# EAGLE design esp8266-board (EAGLE 7.6.0)
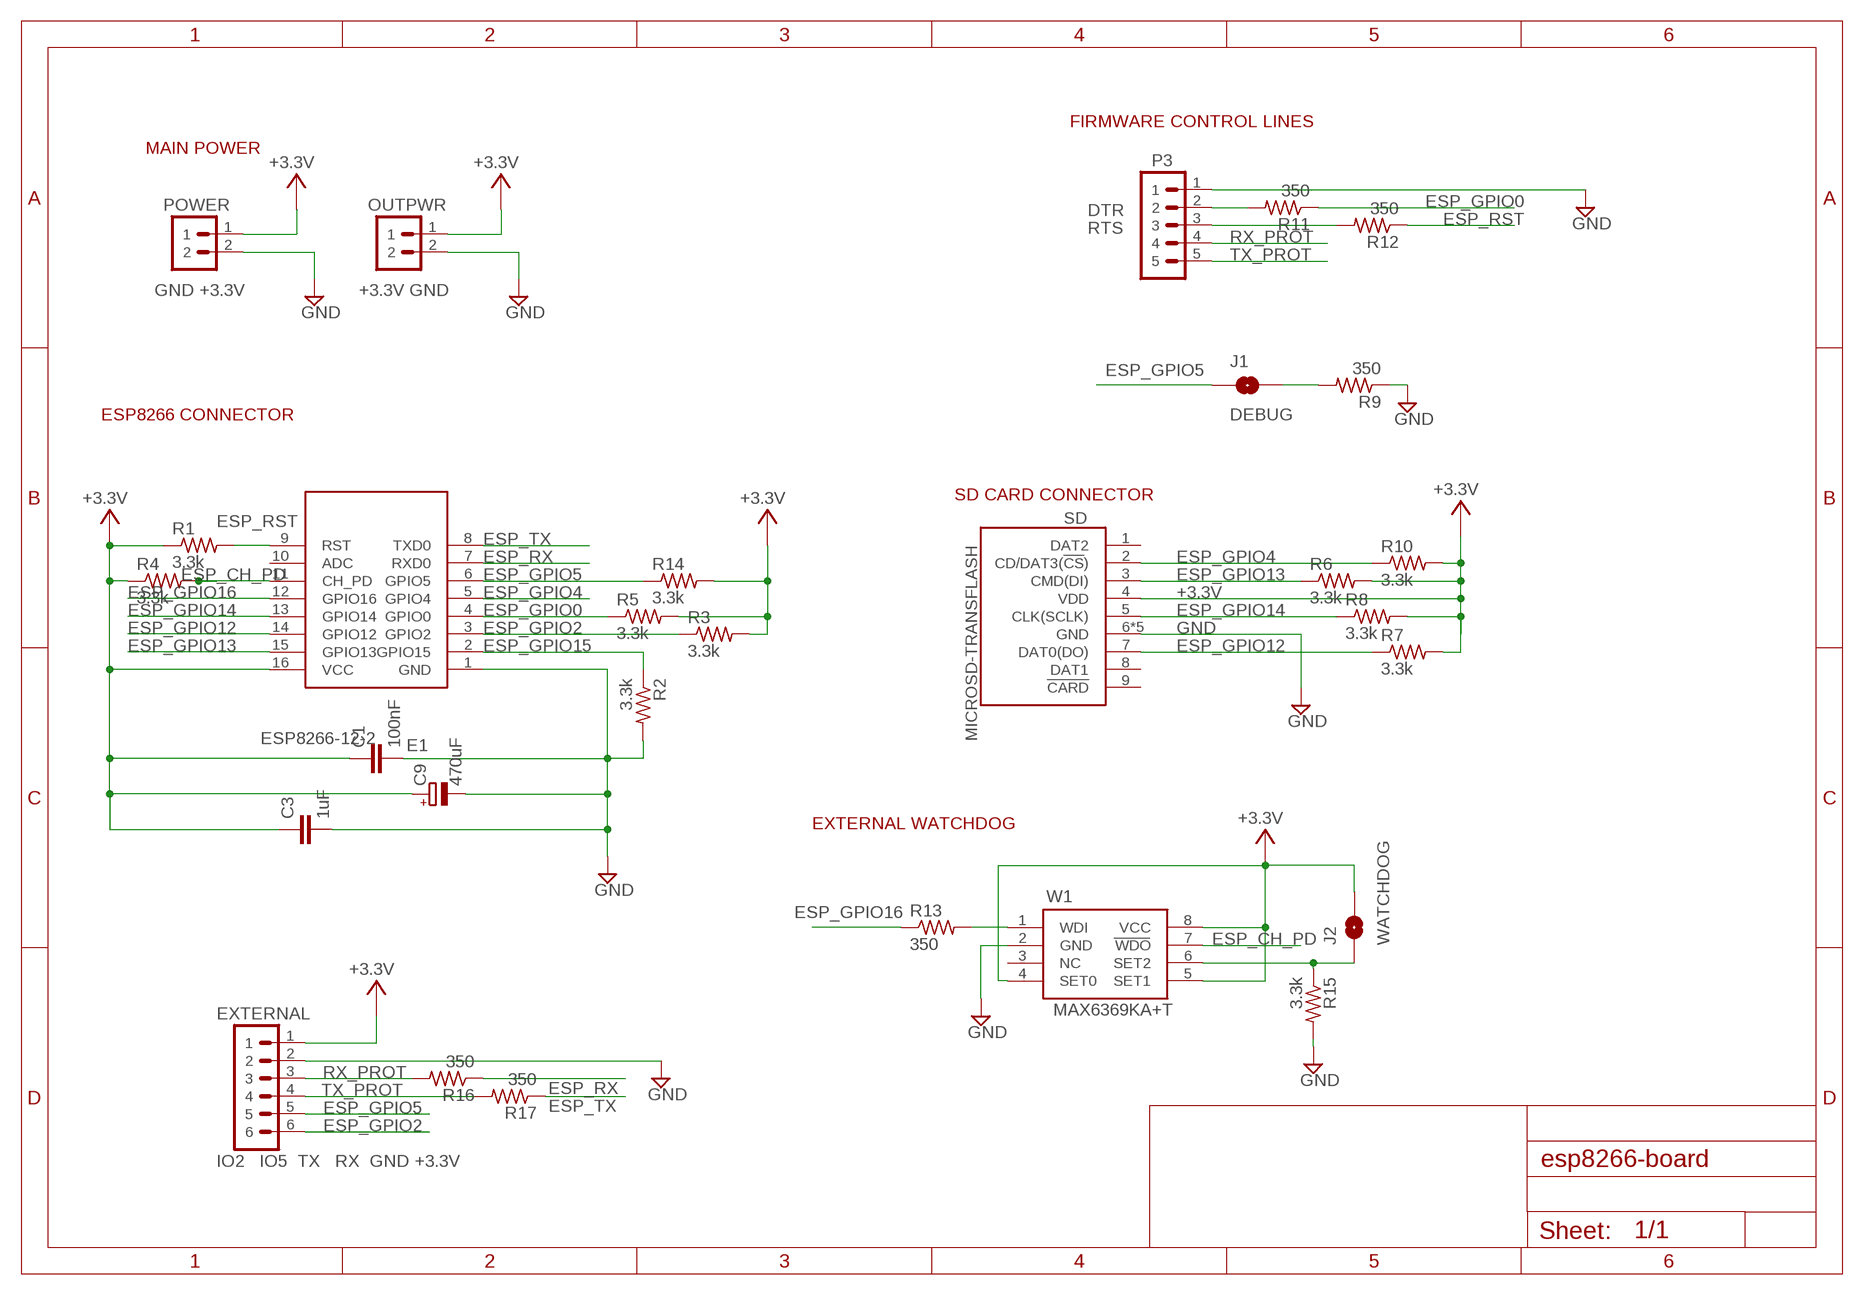
[diagram p0: schematic, sheet 1]

## Parts
C1  100nF  CAPACITOR0805  [SMD0805]
C3  1uF  CAPACITOR0805  [SMD0805]
C9  470uF  CPOL-EUE2.5-6  [E2,5-6]
E1  ESP8266-12-2  [ESP8266-12-2]
EXTERNAL  IO2 IO5 TX RX GND +3.3V  PIN-HEADER-6PIN  [PIN-HEADER-6PIN]
J1  DEBUG  JUMPER-PAD-2ROUND  [JUMPER-PAD-2-ROUND]
J2  WATCHDOG  JUMPER-PAD-2ROUND  [JUMPER-PAD-2-ROUND]
OUTPWR  +3.3V GND  PIN-HEADER-2PIN  [PIN-HEADER-2PIN]
P3  GND DTR RTS RX TX  PIN-HEADER-5PIN  [PIN-HEADER-5PIN]
POWER  GND +3.3V  PIN-HEADER-2PIN  [PIN-HEADER-2PIN]
R1  3.3k  RESISTOR0805  [SMD0805]
R2  3.3k  RESISTOR0805  [SMD0805]
R3  3.3k  RESISTOR0805  [SMD0805]
R4  3.3k  RESISTOR0805  [SMD0805]
R5  3.3k  RESISTOR0805  [SMD0805]
R6  3.3k  RESISTOR0805  [SMD0805]
R7  3.3k  RESISTOR0805  [SMD0805]
R8  3.3k  RESISTOR0805  [SMD0805]
R9  350  RESISTOR0805  [SMD0805]
R10  3.3k  RESISTOR0805  [SMD0805]
R11  350  RESISTOR0805  [SMD0805]
R12  350  RESISTOR0805  [SMD0805]
R13  350  RESISTOR0805  [SMD0805]
R14  3.3k  RESISTOR0805  [SMD0805]
R15  3.3k  RESISTOR0805  [SMD0805]
R16  350  RESISTOR0805  [SMD0805]
R17  350  RESISTOR0805  [SMD0805]
SD  MICROSD-TRANSFLASH  [MICROSD-TRANSFLASH]
W1  MAX6369KA+T  MAX6369-74  [SOT23-8]

## Nets
+3.3V [power-1A]: C1.1 C3.1 C9.+ E1.16(VCC) EXTERNAL.1 J2.2 OUTPWR.1 POWER.1 R1.1 R3.2 R4.1 R5.2 R6.2 R7.2 R8.2 R10.2 R14.2 SD.4(VDD) W1.4(SET0) W1.5(SET1) W1.8(VCC)
ESP_CH_PD: E1.11(CH_PD) R4.2 W1.7(WDO)
ESP_GPIO0: E1.4(GPIO0) R5.1 R11.1
ESP_GPIO2: E1.3(GPIO2) EXTERNAL.6 R3.1
ESP_GPIO4: E1.5(GPIO4) R10.1 SD.2(CD/DAT3(!CS!))
ESP_GPIO5: E1.6(GPIO5) EXTERNAL.5 J1.1 R14.1
ESP_GPIO12: E1.14(GPIO12) R7.1 SD.7(DAT0(DO))
ESP_GPIO13: E1.15(GPIO13) R6.1 SD.3(CMD(DI))
ESP_GPIO14: E1.13(GPIO14) R8.1 SD.5(CLK(SCLK))
ESP_GPIO15: E1.2(GPIO15) R2.1
ESP_GPIO16: E1.12(GPIO16) R13.1
ESP_RST: E1.9(RST) R1.2 R12.1
ESP_RX: E1.7(RXD0) R16.1
ESP_TX: E1.8(TXD0) R17.1
GND [power-1A]: C1.2 C3.2 C9.- E1.1(GND) EXTERNAL.2 OUTPWR.2 P3.1 POWER.2 R2.2 R9.1 R15.2 SD.6(GND) SD.S1(GND) SD.S2(GND) SD.S3(GND) SD.S4(GND) W1.2(GND)
N$1: J2.1 R15.1 W1.6(SET2)
N$6: J1.2 R9.2
N$7: P3.2 R11.2
N$8: P3.3 R12.2
N$10: R13.2 W1.1(WDI)
RX_PROT: EXTERNAL.3 P3.4 R16.2
TX_PROT: EXTERNAL.4 P3.5 R17.2
Unconnected: E1.10(ADC) SD.1(DAT2) SD.8(DAT1) SD.9(!CARD) W1.3(NC)

## Notes on the sheet
- FIRMWARE CONTROL LINES
- MAIN POWER
- DTR
- RTS
- ESP8266 CONNECTOR
- SD CARD CONNECTOR
- EXTERNAL WATCHDOG

## Library data of the parts
C1 C3 = stutz-components-library:CAPACITOR
C9 = rcl:CPOL-EU: POLARIZED CAPACITOR, European symbol
E1 = stutz-components-library:ESP8266-12-2
EXTERNAL = stutz-components-library:PIN-HEADER-6PIN
J1 J2 = stutz-components-library:JUMPER-PAD-2
OUTPWR POWER = stutz-components-library:PIN-HEADER-2PIN
P3 = stutz-components-library:PIN-HEADER-5PIN
R1-R17 = stutz-components-library:RESISTOR
SD = stutz-components-library:MICROSD-TRANSFLASH
W1 = stutz-components-library:MAX6369-74

## Net classes
0 default: width 0.254 mm, clearance 0.16 mm
1 power-4A: width 2 mm, clearance 0.2 mm
2 comm-rs485: width 1 mm, clearance 0.2 mm
3 power-2A: width 1 mm, clearance 0.2 mm
4 power-1.7A: width 0.8 mm, clearance 0.2 mm
5 power-1A: width 0.254 mm, clearance 0.2 mm

## Board
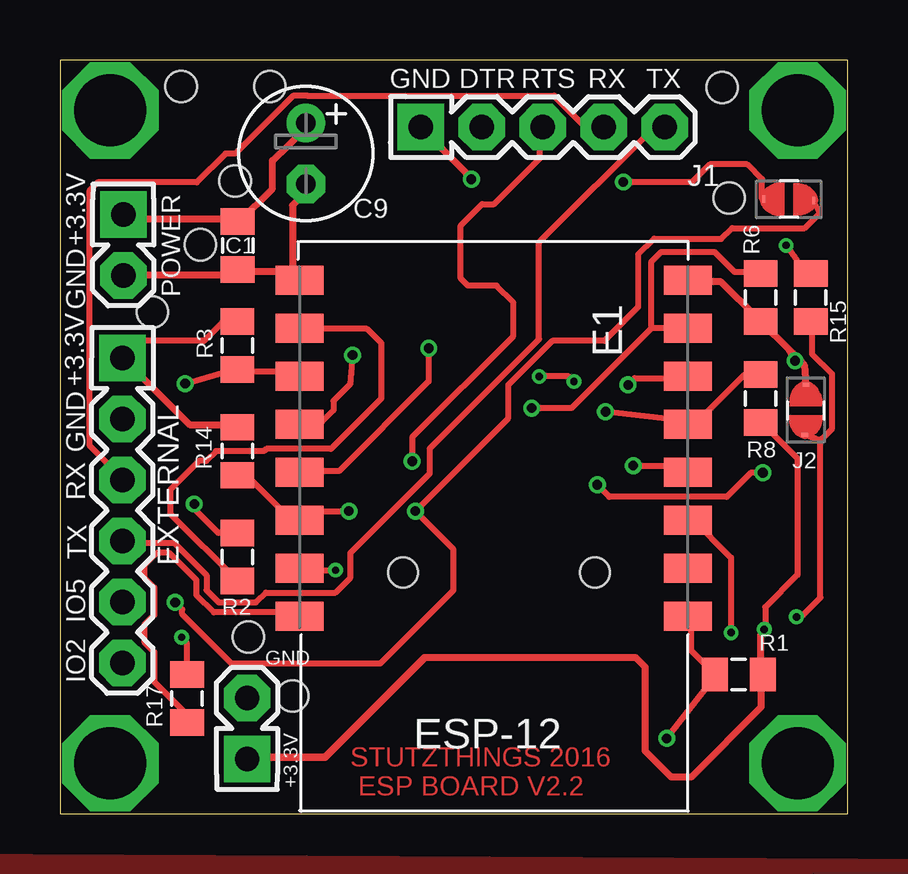
[diagram p1: board, top side]
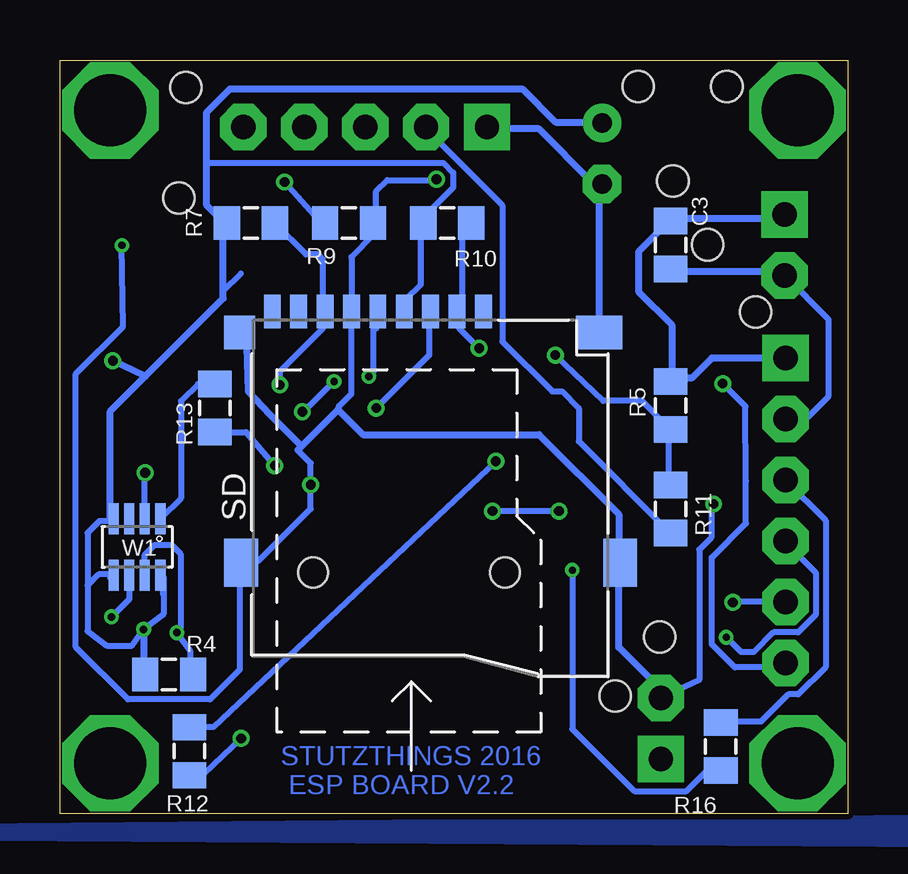
[diagram p2: board, bottom side, seen from below]

Size 32.85 x 31.4 mm. Coordinates in mm from the lower left corner, seen from the top.
Outline: 0,0 32.85,0 32.85,31.4 0,31.4 0,0
Copper layers (1*16): Top 0.035mm / dielectric 1.5mm / Bottom 0.035mm
Design rules "SeeedStudio_2layer_DRU_no_angle_20140221": minimum track width 6mil, minimum drill 12mil, track to track 6mil, track to pad 6mil, pad to pad 6mil, via to via 6mil, smd to smd 0mil, copper to edge 10mil, drill to drill 10mil, minimum pad ring 10mil, minimum via ring 6mil, stop-mask expansion 2mil, vias tented up to drill 100mil, thermal gap 10mil
Holes 1.3 mm at 7.85,7.35 9.7,4.9 3.85,20.9 7.3,26.35 5.05,30.3 8.75,30.3 5.85,23.7 27.9,25.65 27.6,30.25
bRestrict: area 12.1,0.8 to 24.1,6.2

### Footprints (pad centres in the part's own frame; a part is rotated, then mirrored left to right if it is on the bottom)
SMD0805 = smd 1.1 x 1.4: 1 -1,0; 2 1,0
E2,5-6 = drill 0.813 pad 1.6: + -1.27,0 | drill 0.813 pad 1.6 octagon: - 1.27,0
ESP8266-12-2 = smd 2 x 1.2: 1 7.818,-8.922; 2 7.818,-6.922; 3 7.818,-4.922; 4 7.818,-2.922; 5 7.818,-0.922; 6 7.818,1.078; 7 7.818,3.078; 8 7.818,5.078; 9 -8.382,5.078; 10 -8.382,3.078; 11 -8.382,1.078; 12 -8.382,-0.922; 13 -8.382,-2.922; 14 -8.382,-4.922; 15 -8.382,-6.922; 16 -8.382,-8.922
PIN-HEADER-6PIN = drill 1.016 pad 1.93 square: 1 -5.08,0 | drill 1.016 pad 1.93 octagon: 2 -2.54,0; 3 0,0; 4 2.54,0; 5 5.08,0; 6 7.62,0
JUMPER-PAD-2-ROUND = smd 0.152 x 0.305: 1 -1.016,0.051; 2 1.067,0
PIN-HEADER-2PIN = drill 1.016 pad 1.93 square: 1 -1.27,0 | drill 1.016 pad 1.93 octagon: 2 1.27,0
PIN-HEADER-5PIN = drill 1.016 pad 1.93 square: 1 -5.08,0 | drill 1.016 pad 1.93 octagon: 2 -2.54,0; 3 0,0; 4 2.54,0; 5 5.08,0
MICROSD-TRANSFLASH = smd 1.4 x 0.7: 1 15.22,5.2; 2 15.22,6.3; 3 15.22,7.4; 4 15.22,8.5; 5 15.22,9.6; 6 15.22,10.7; 7 15.22,11.8; 8 15.22,12.9; 9 15.22,14 | smd 2 x 1.4: S1 4.75,-0.5; S2 4.75,15.3 | smd 1.4 x 1.28: S3 14.35,15.36 | smd 1.4 x 1.95: S4 14.35,0.375 | hole 1.25: 4.35,4.3; 4.35,12.3
SOT23-8 = smd 0.42 x 1.3: 1 0.936,1.08; 2 0.286,1.08; 3 -0.364,1.08; 4 -1.014,1.08; 5 -1.014,-1.27; 6 -0.364,-1.27; 7 0.286,-1.27; 8 0.936,-1.27

### Placement (x,y rotation side)
C1  7.41,23.66 270 top
C3  7.4,23.7 270 bottom
C9  10.25,27.5 270 top
E1  17.8,13.3 180 top
EXTERNAL  2.6,13.9 270 top
J1  30.4,25.6 180 top
J2  31.1,16.8 90 top
OUTPWR  7.8,3.55 90 top
P3  20.13,28.6 0 top
POWER  2.64,23.69 270 top
R1  28.3,5.8 180 top
R2  7.4,10.7 90 top
R3  7.4,19.5 90 top
R4  28.3,5.8 0 bottom
R5  7.4,17 90 bottom
R6  29.2,21.5 270 top
R7  24.9,24.6 180 bottom
R8  29.2,17.3 270 top
R9  20.8,24.6 180 bottom
R10  16.7,24.6 180 bottom
R11  7.4,12.7 270 bottom
R12  27.45,2.6 90 bottom
R13  26.4,16.9 90 bottom
R14  7.4,15.1 90 top
R15  31.3,21.5 90 top
R16  5.3,2.8 90 bottom
R17  5.3,4.8 90 top
SD  10,5.7 90 bottom
W1  29.6,11.2 0 bottom

### Tracks (layer width: path | path; a pad name or v marks a point on that pad's centre or on a via)
+3.3V  (via drill 0.31, 0.4)
  Top 0.254: R3.2 6.8,20.5 6,19.7 3.32,19.7 EXTERNAL.1 | 29.22,16.2 29.34,16.2 30.75,14.8 30.75,9.95 29.4,8.6 29.4,7.72 v29.36,7.68
  Top 0.3: R14.2 7.34,16.2 5.4,16.2 2.63,18.97 EXTERNAL.1 | POWER.1 2.77,24.93 2.91,24.79 7.34,24.79 C1.1 7.48,24.65 8.86,26.04 8.86,27.2 10.23,28.52 10.53,28.67 C9.+ | 30.4,19.32 29.22,20.5 R6.2 29.09,20.64 27.56,22.16 26.32,22.16 E1.16 | 30.4,19.32 31.02,18.7 J2.2 | v30.65,18.87 30.4,19.32 | 29.22,16.2 R8.2 | 7.2,2.08 OUTPWR.1 8.03,2.13 | v29.36,7.68 29.22,7.48 29.22,5.82 R4.1 29.22,5.68 29.22,4.43 26.32,1.52 25.48,1.52 24.4,2.61 24.4,6.1 24,6.5 15.19,6.5
  Top 0.305: 15.19,6.5 15.19,6.49 11.05,2.35 7.87,2.35 OUTPWR.1
  Bottom 0.254: 30.75,12.19 31.21,12.19 31.7,11.7 31.7,9.5 | 31.7,9.5 31.7,7.6 30.9,7 29.84,7 v29.36,7.68 28.53,8.31 28.53,9.14 | 30.75,9.97 31.23,9.97 31.7,9.5 | 26.04,21.47 26.04,21.76 25.3,22.5 | SD.4 18.42,21.01 18.42,21.42 17.8,22.05 17.8,24.53 R10.2 17.59,24.63 17.59,24.94 16.46,26.08 16.46,26.7 16.87,27.12 26.73,27.12
  Bottom 0.3: 7.48,18 R5.2 | R5.2 7.34,18.14 6.51,18.14 5.68,18.97 2.63,18.97 EXTERNAL.1 | POWER.1 2.77,24.93 2.91,24.79 7.34,24.79 C3.1 7.48,24.65 8.73,23.41 8.73,21.74 7.34,20.36 7.34,18.28 R5.2 | 28.53,9.14 28.53,9.83 W1.8 | 30.75,9.83 W1.5 30.75,9.97 | 30.75,12.19 W1.4 30.75,12.33 30.75,16.76 29.29,18.21 | v29.36,7.68 29.36,5.82 R4.1 | 29.29,18.21 26.04,21.47 26.04,24.52 R7.2 26.04,24.65 26.73,25.35 26.73,27.12 26.73,29.22 25.76,30.19 13.57,30.19 12.19,28.81 10.66,28.81 C9.+ | 29.29,18.21 v30.65,18.87
ESP_CH_PD  (via drill 0.31)
  Top 0.254: v27.98,7.54 27.98,10.66 26.32,12.33 E1.11
  Bottom 0.254: R4.2 27.42,5.82 27.42,6.79 v27.98,7.54 27.82,7.7 27.82,10.82 28.2,11.2 28.9,11.2 29.31,10.79 W1.7
ESP_GPIO0  (via drill 0.4)
  Top 0.254: v12.2,19.1 12.1,17.9 11.4,17.2 11.4,16.8 10.5,15.9 10.3,15.9 E1.4
  Bottom 0.254: 7.48,13.71 R11.1 7.48,13.78 7.48,15.93 | 7.48,15.93 R5.1 | 7.48,15.93 7.48,16.08 8.6,17.2 10.2,17.2 v12.2,19.1
ESP_GPIO2  (via drill 0.4)
  Top 0.254: E1.3 9.97,18.28 9.83,18.42 7.48,18.42 R3.1 7.34,18.42 6.92,18.42 v5.22,17.91
  Bottom 0.254: v5.22,17.91 4.27,16.97 4.25,13.85 4.25,12.1 5.68,10.66 5.68,7.06 4.71,6.09 2.77,6.09 2.63,6.23 EXTERNAL.6
ESP_GPIO4  (via drill 0.4)
  Top 0.254: v15.37,19.39 15.37,18 11.63,14.27 10.11,14.27 E1.5
  Bottom 0.254: R10.1 16.07,24.1 16.07,21.19 16.2,21.05 SD.2 16.2,20.91 16.2,20.22 v15.37,19.39
ESP_GPIO5  (via drill 0.4)
  Top 0.254: 27.56,23.96 24.76,23.96 24.1,23.3 24.1,21.1 22.7,19.7 20.53,19.7 18.7,17.87 18.7,16.48 v14.82,12.6 16.4,11.02 16.4,9.3 13.35,6.25 7.15,6.25 5.1,8.3 5.1,8.5 v4.8,8.8 | v12.05,12.6 10.39,12.6 10.11,12.33 E1.6 9.97,12.33 9.56,12.33 7.89,13.99 7.48,13.99 R14.1
  Top 0.256: 27.56,23.96 27.57,23.95 28.02,24.4 31.05,24.4 31.67,25.02 J1.1
  Bottom 0.254: v12.05,12.6 v14.82,12.6 | EXTERNAL.5 4.68,8.82 v4.8,8.8
ESP_GPIO12  (via drill 0.4)
  Top 0.254: v23.68,17.87 23.96,18.14 26.18,18.14 E1.14
  Bottom 0.254: 23.82,24.24 23.82,24.52 R7.1 22.6,23.3 22.1,23.3 21.88,23.08 21.88,21.05 SD.7 21.88,20.91 21.88,20.22 23.68,18.42 v23.68,17.87
ESP_GPIO13  (via drill 0.4)
  Top 0.254: v19.67,16.9 21.33,16.9 24.65,20.22 | 24.65,20.22 E1.15 | 24.65,20.22 24.65,22.99 25.07,23.41 27.29,23.41 28.12,22.58 29.09,22.58 R6.1
  Bottom 0.254: v19.67,16.9 17.45,19.11 17.45,20.91 SD.3
ESP_GPIO14  (via drill 0.3, 0.4)
  Top 0.254: R8.1 29.09,18.28 28.53,18.28 26.59,16.34 26.32,16.34 E1.13 26.18,16.34 v22.75,16.74 | v19.98,18.22 21.22,18.22 v21.42,18.01
  Bottom 0.254: SD.5 19.67,20.91 19.67,20.22 19.77,20.18 19.77,18.42 v19.98,18.22 | v21.42,18.01 22.67,16.77 v22.75,16.74
ESP_GPIO15
  Top 0.254: R2.1 4.6,12.5 4.6,13.5 5.8,14.7 6.1,14.7 6.5,15.1 8.5,15.1 8.6,15.2 11.3,15.2 13.4,17.3 13.4,19.6 12.8,20.2 10,20.2 E1.2
ESP_GPIO16  (via drill 0.4)
  Top 0.254: v23.9,14.5 25.7,14.5 E1.12
  Bottom 0.254: R13.1 25.1,15.9 v23.9,14.5
ESP_RST  (via drill 0.4)
  Top 0.254: v25.3,3.13 25.4,3.29 27.29,5.68 R1.2 27.29,5.82 26.32,6.79 26.32,8.17 E1.9
  Bottom 0.254: v25.3,3.13 26.87,1.66 27.29,1.66 R12.1
ESP_RX  (via drill 0.3)
  Top 0.254: v11.49,10.14 10.04,10.14 E1.7
  Bottom 0.254: v11.49,10.14 11.49,3.52 8.9,0.93 6.73,0.93 5.9,1.76 5.38,1.76 R16.1
ESP_TX
  Top 0.254: R17.1 5.28,3.83 5.28,4.14 3.93,5.49 3.93,6.73 3.52,7.14 3.52,7.87 3.93,8.28 3.93,9.42 3.52,9.83 3.52,10.35 4.04,10.87 4.55,10.87 5.69,9.73 5.69,9.11 6.42,8.38 9.83,8.38 9.94,8.28 E1.8
GND  (via drill 0.3, 0.4)
  Top 0.254: 2.64,16.4 EXTERNAL.2 | R2.2 6.6,11.7 5.6,12.7 v5.6,12.9 | v29.3,14.2 28.8,14.2 27.8,13.2 22.9,13.2 v22.4,13.7 | v30.27,23.68 31.08,22.53 31.26,22.46 R15.2
  Top 0.3: v17.15,26.43 16.9,26.73 15.1,28.53 P3.1 | C9.- 10.53,26.18 9.7,25.35 9.7,22.71 E1.1 9.97,22.3 9.7,22.58 7.48,22.58 C1.2 7.48,22.44 2.77,22.44 POWER.2
  Bottom 0.254: EXTERNAL.2 1.76,16.44 0.8,17.4 0.8,20.58 POWER.2 | v5.6,12.9 5.7,12.8 5.7,11.5 6.2,11 6.2,5.57 OUTPWR.2 | W1.2 29.31,14.19 v29.3,14.2 | 22.94,15.14 22.4,14.6 v22.4,13.7 22.4,12.7 24.57,10.53 25.21,10.53 | 19.67,24.24 19.67,24.17 | 19.67,24.52 19.67,25.93 19.2,26.4 17.18,26.4 v17.15,26.43 | v30.27,23.68 30.22,20.29 32.19,18.32 32.19,6.93 30.02,4.76 26.6,4.76 25.36,6 25.36,10.35 SD.S2 | R9.1 19.77,24.12 20.7,23.18 SD.6 20.7,17.49 21.22,16.97 21.26,16.83
  Bottom 0.3: 7.76,22.58 7.48,22.58 C3.2 7.34,22.58 2.91,22.58 2.77,22.44 POWER.2 | 19.67,24.52 19.67,24.24 R9.1 | SD.S4 10.39,20.08 10.39,26.04 10.53,26.18 C9.- 10.66,26.32 12.88,28.53 14.96,28.53 P3.1 | OUTPWR.2 7.2,4.57 9.56,6.92 9.56,10.39 SD.S1 9.56,10.53 9.56,12.46 12.88,15.79 20.22,15.79 21.26,16.83 22.78,15.31 | 22.94,15.14 22.78,15.31 | 25.21,10.53 SD.S2 | 22.78,15.31 24.09,16.63 24.99,17.58 25.05,19.44 25.35,19.94 SD.S3
  pour Bottom: -4.3,40.1 -3.3,-0.25 54.7,-0.8 -4.3,-1.2
  pour Top: -5.6,41.2 -5,-1.85 56.2,-2.2 -5.9,-2.5
N$1  (via drill 0.31)
  Top 0.254: v30.7,8.2 30.7,8 31.7,9 31.7,15.53 | 31.7,15.53 J2.1 | R15.1 31.36,20.49 31.36,19.15 32.19,18.32 32.19,16.04 31.77,15.63 31.7,15.53
  Bottom 0.254: W1.6 29.96,8.94 v30.7,8.2
N$2  (via drill 3)
  other vias: 30.75,2.1
N$3  (via drill 3)
  other vias: 2.1,2.1
N$4  (via drill 3)
  other vias: 2.1,29.3
N$5  (via drill 3)
  other vias: 30.75,29.3
N$6  (via drill 0.4)
  Top 0.254: J1.2 29.26,25.61 29.26,26.44 28.65,27.05 27.1,27.05 26.35,26.3 23.5,26.3 v23.48,26.32
  Bottom 0.254: v23.48,26.32 21.88,24.52 21.88,24.24 R9.2
N$7
  Bottom 0.254: R11.2 7.48,11.77 11.22,15.51 11.22,16.9 11.91,17.59 12.33,17.59 14.4,19.67 14.4,25.35 17.59,28.53 P3.2
N$8  (via drill 0.4)
  Top 0.254: v14.68,14.68 14.68,15.68 18.9,19.9 18.9,21.3 18.2,22 17,22 16.7,22.3 16.7,24.5 17.6,25.4 18.1,25.4 20,27.3 20,28.48 P3.3 20.08,28.53
  Bottom 0.254: v14.68,14.68 26.46,3.6 27.29,3.6 R12.2
N$10
  Bottom 0.254: R13.2 27.1,17.9 27.8,17.2 27.8,13.14 W1.1
RX_PROT
  Top 0.254: P3.4 22.67,28.67 21.84,28.67 20.6,29.91 10.31,29.91 9.71,29.91 7.3,27.5 6.9,27.5 5.7,26.3 1.56,26.3 1.24,25.98 1.24,15.32 2.59,13.97 EXTERNAL.3
  Bottom 0.254: R16.2 5.28,3.83 3.62,3.83 2.48,4.97 2.07,4.97 0.93,6.11 0.93,12.21 2.59,13.87 EXTERNAL.3
TX_PROT  (via drill 0.3)
  Top 0.254: v5.07,7.35 5.28,7.14 5.28,5.9 R17.2 | P3.5 25.15,28.57 24.74,28.57 19.98,23.8 19.98,19.77 15.42,15.21 15.42,14.18 12.11,10.87 12.11,9.83 11.49,9.21 8.59,9.21 8.18,8.8 6.62,8.8 6.11,9.31 6.11,9.94 4.76,11.28 2.69,11.28 EXTERNAL.4
  Bottom 0.254: v5.07,7.35 4.45,6.73 3.93,6.73 3.1,7.56 2.07,7.56 1.34,8.28 1.34,10.04 2.59,11.28 EXTERNAL.4

### Text on the board
Top: STUTZTHINGS 2016 / ESP BOARD V2.2
Bottom: STUTZTHINGS 2016 / ESP BOARD V2.2
tNames: GND | DTR | RTS | RX | TX | +3.3V | GND | +3.3V | GND | RX | TX | IO5 | GND | IO2 | +3.3V